# EAGLE design minimal_terminal (EAGLE 7.6.0)
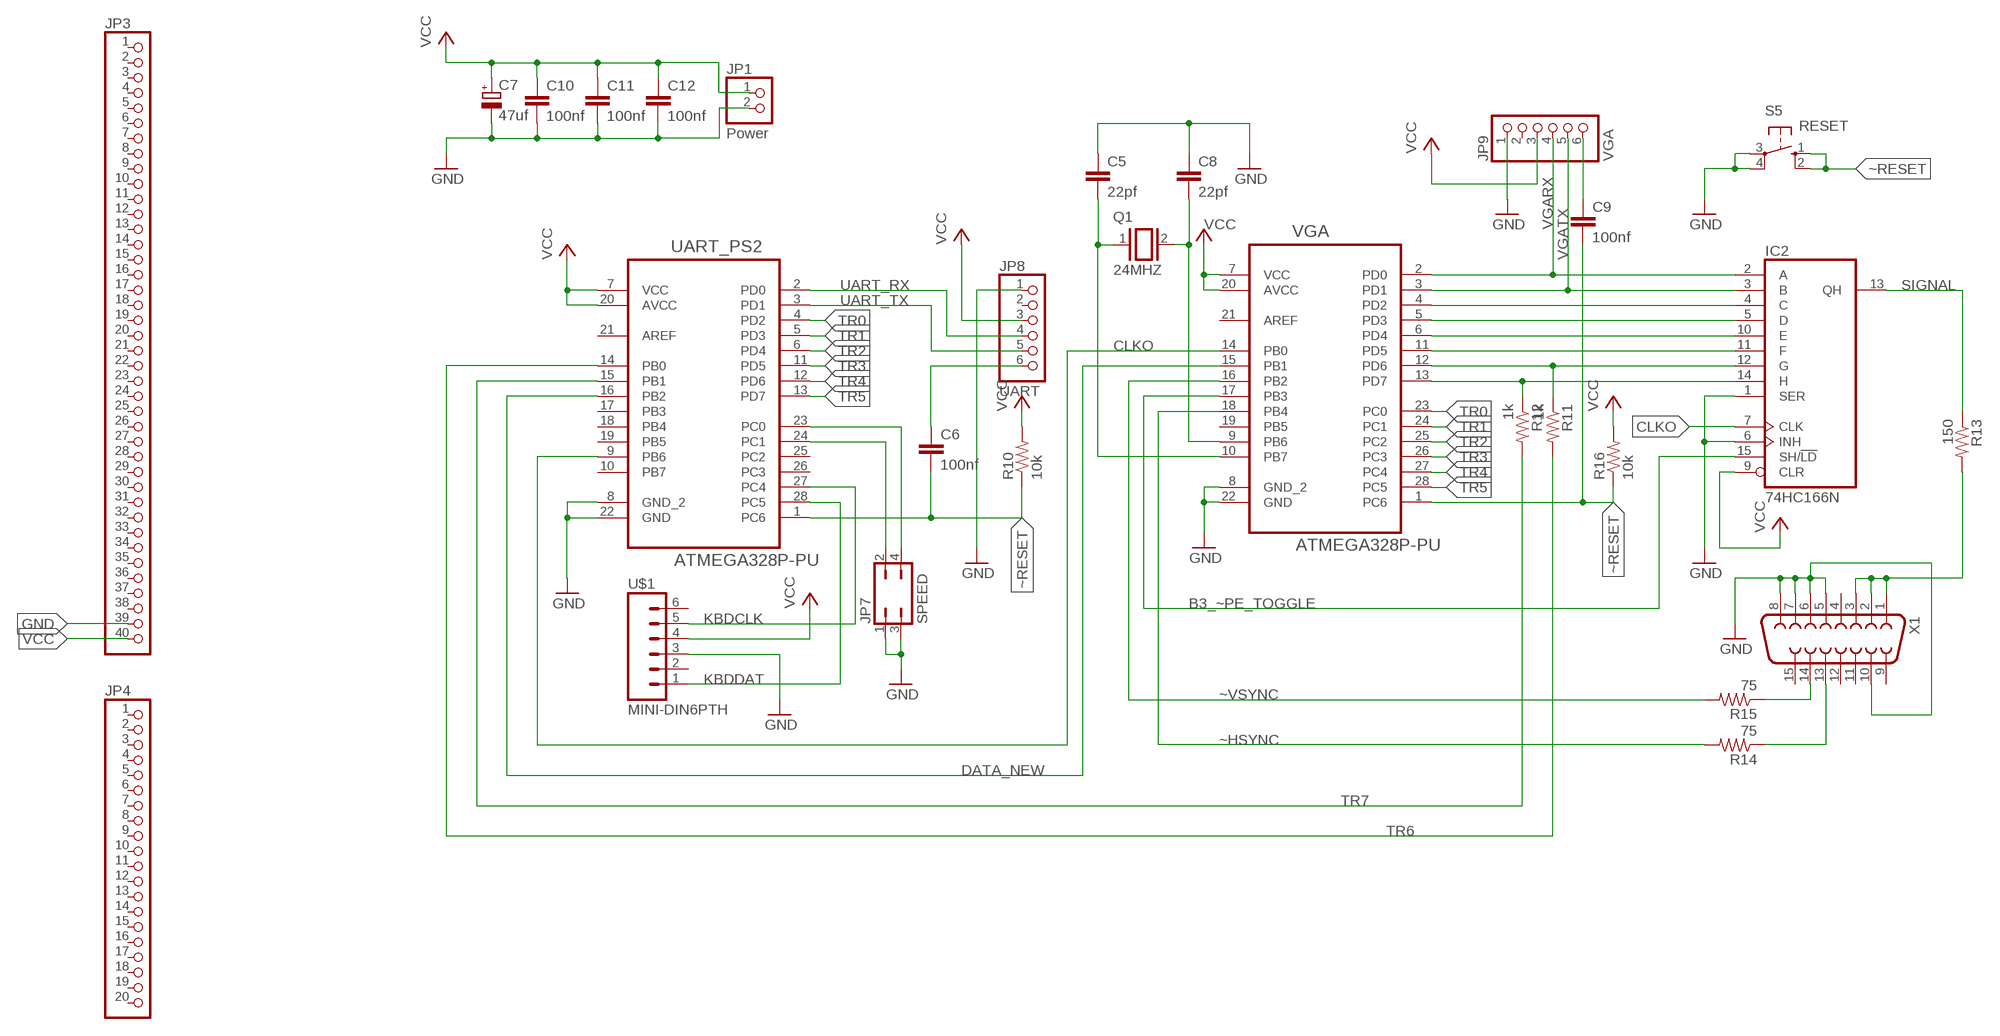
[diagram p0: schematic, sheet 1]

## Parts
C5  22pf  C2,5-3  [C2.5-3]
C6  100nf  C2,5-3  [C2.5-3]
C7  47uf  CPOL-EUE2.5-6  [E2,5-6]
C8  22pf  C2,5-3  [C2.5-3]
C9  100nf  C2,5-3  [C2.5-3]
C10  100nf  C2,5-3  [C2.5-3]
C11  100nf  C2,5-3  [C2.5-3]
C12  100nf  C2,5-3  [C2.5-3]
IC2  74HC166N  [DIL16]
JP1  Power  PINHD-1X2  [1X02]
JP3  PINHD-1X40  [1X40]
JP4  PINHD-1X20  [1X20]
JP7  SPEED  JP2Q  [JP2Q]
JP8  UART  PINHD-1X6  [1X06]
JP9  VGA  PINHD-1X6  [1X06]
Q1  24MHZ  XTAL  [Q]
R10  10k  R-US_0204/7  [0204/7]
R11  1k  R-US_0204/7  [0204/7]
R12  1k  R-US_0204/7  [0204/7]
R13  150  R-US_0204/7  [0204/7]
R14  75  R-US_0204/7  [0204/7]
R15  75  R-US_0204/7  [0204/7]
R16  10k  R-US_0204/7  [0204/7]
S5  RESET  10-XX  [B3F-10XX]
U$1  MINI-DIN6PTH  [MINI-DIN6]
UART_PS2  ATMEGA328P-PU  [DIP254P762X457-28]
VGA  ATMEGA328P-PU  [DIP254P762X457-28]
X1  F15HDH  [HDF15H]

## Nets
B3_~PE_TOGGLE: IC2.15(SH/!LD) VGA.17(PB3)
CLKO: IC2.7(CLK) UART_PS2.9(PB6) VGA.14(PB0)
DATA_NEW: UART_PS2.16(PB2) VGA.15(PB1)
GND [VCC]: C5.1 C7.- C8.1 C10.2 C11.2 C12.2 IC2.1(SER) IC2.6(INH) JP1.2 JP3.39 JP7.1 JP7.3 JP8.1 JP9.1 S5.3(P) S5.4(P1) U$1.3 UART_PS2.8(GND_2) UART_PS2.22(GND) VGA.8(GND_2) VGA.22(GND) X1.5 X1.6 X1.7 X1.8 X1.10
KBDCLK: U$1.5 UART_PS2.27(PC4)
KBDDAT: U$1.1 UART_PS2.28(PC5)
N$14: C6.1 JP8.6
N$15: JP7.2 UART_PS2.24(PC1)
N$16: JP7.4 UART_PS2.23(PC0)
N$17: IC2.12(G) R11.1 VGA.12(PD6)
N$18: IC2.14(H) R12.1 VGA.13(PD7)
N$21: IC2.4(C) VGA.4(PD2)
N$22: IC2.5(D) VGA.5(PD3)
N$23: IC2.10(E) VGA.6(PD4)
N$24: IC2.11(F) VGA.11(PD5)
N$26: R13.2 X1.1 X1.2 X1.3
N$27: R14.1 X1.13
N$28: R15.1 X1.14
N$29: C5.2 Q1.1 VGA.10(PB7)
N$30: C8.2 Q1.2 VGA.9(PB6)
N$31: C9.1 JP9.6
SIGNAL: IC2.13(QH) R13.1
TR0: UART_PS2.4(PD2) VGA.23(PC0)
TR1: UART_PS2.5(PD3) VGA.24(PC1)
TR2: UART_PS2.6(PD4) VGA.25(PC2)
TR3: UART_PS2.11(PD5) VGA.26(PC3)
TR4: UART_PS2.12(PD6) VGA.27(PC4)
TR5: UART_PS2.13(PD7) VGA.28(PC5)
TR6: R11.2 UART_PS2.14(PB0)
TR7: R12.2 UART_PS2.15(PB1)
UART_RX: JP8.4 UART_PS2.2(PD0)
UART_TX: JP8.5 UART_PS2.3(PD1)
VCC [VCC]: C7.+ C10.1 C11.1 C12.1 IC2.9(CLR) JP1.1 JP3.40 JP8.3 JP9.3 R10.2 R16.2 U$1.4 UART_PS2.7(VCC) UART_PS2.20(AVCC) VGA.7(VCC) VGA.20(AVCC)
VGARX: IC2.2(A) JP9.4 VGA.2(PD0)
VGATX: IC2.3(B) JP9.5 VGA.3(PD1)
~HSYNC: R14.2 VGA.18(PB4)
~RESET: C6.2 C9.2 R10.1 R16.1 S5.1(S) S5.2(S1) UART_PS2.1(PC6) VGA.1(PC6)
~VSYNC: R15.2 VGA.16(PB2)
Unconnected: JP3.1 JP3.2 JP3.3 JP3.4 JP3.5 JP3.6 JP3.7 JP3.8 JP3.9 JP3.10 JP3.11 JP3.12 JP3.13 JP3.14 JP3.15 JP3.16 JP3.17 JP3.18 JP3.19 JP3.20 JP3.21 JP3.22 JP3.23 JP3.24 JP3.25 JP3.26 JP3.27 JP3.28 JP3.29 JP3.30 JP3.31 JP3.32 JP3.33 JP3.34 JP3.35 JP3.36 JP3.37 JP3.38 JP4.1 JP4.2 JP4.3 JP4.4 JP4.5 JP4.6 JP4.7 JP4.8 JP4.9 JP4.10 JP4.11 JP4.12 JP4.13 JP4.14 JP4.15 JP4.16 JP4.17 JP4.18 JP4.19 JP4.20 JP8.2 JP9.2 U$1.2 U$1.6 UART_PS2.10(PB7) UART_PS2.17(PB3) UART_PS2.18(PB4) UART_PS2.19(PB5) UART_PS2.21(AREF) UART_PS2.25(PC2) UART_PS2.26(PC3) VGA.19(PB5) VGA.21(AREF) X1.4 X1.9 X1.11 X1.12 X1.15

## Power pins joined to a net without a drawn wire
GND: IC2.8(GND)
VCC: IC2.16(VCC)

## Library data of the parts
C5 C6 C8-C12 = capacitor-wima:C: CAPACITOR naming: grid - package width
C7 = rcl:CPOL-EU: POLARIZED CAPACITOR, European symbol
IC2 = 74xx-eu:74*166: 8-bit parallel load SHIFT REGISTER
JP1 = pinhead:PINHD-1X2: PIN HEADER
JP3 = pinhead:PINHD-1X40: PIN HEADER
JP4 = pinhead:PINHD-1X20: PIN HEADER
JP7 = jumper:JP2Q: JUMPER
JP8 JP9 = adafruit:PINHD-1X6: PIN HEADER
Q1 = special:XTAL: CRYSTAL
R10-R16 = adafruit:R-US_: RESISTOR, American symbol
S5 = switch-omron:10-XX: OMRON SWITCH; MPN: B3F-1000; OC_FARNELL: 176432; OC_NEWARK: 36M3542
U$1 = SparkFun-Connectors:MINI-DIN6: mini DIN 6 Connector Commonly found on the back of a computer for PS2 keyboard and mice. Schematic and footprint are proven. Spark Fun Electronics SKU : PRT-08509
UART_PS2 VGA = Atmel_By_element14_Batch_1-00:ATMEGA328P-PU: 8-bit Microcontroller with In-System Programmable Flash; MPN: ATMEGA328P-PU; OC_FARNELL: 1715487; OC_NEWARK: 15R0268; PACKAGE: PDIP-28; SUPPLIER: Atmel
X1 = adafruit:F15: SUB-D HDH is also known as a 'right angle VGA' connector

## Net classes
1 VCC: width 0.61 mm

## Board
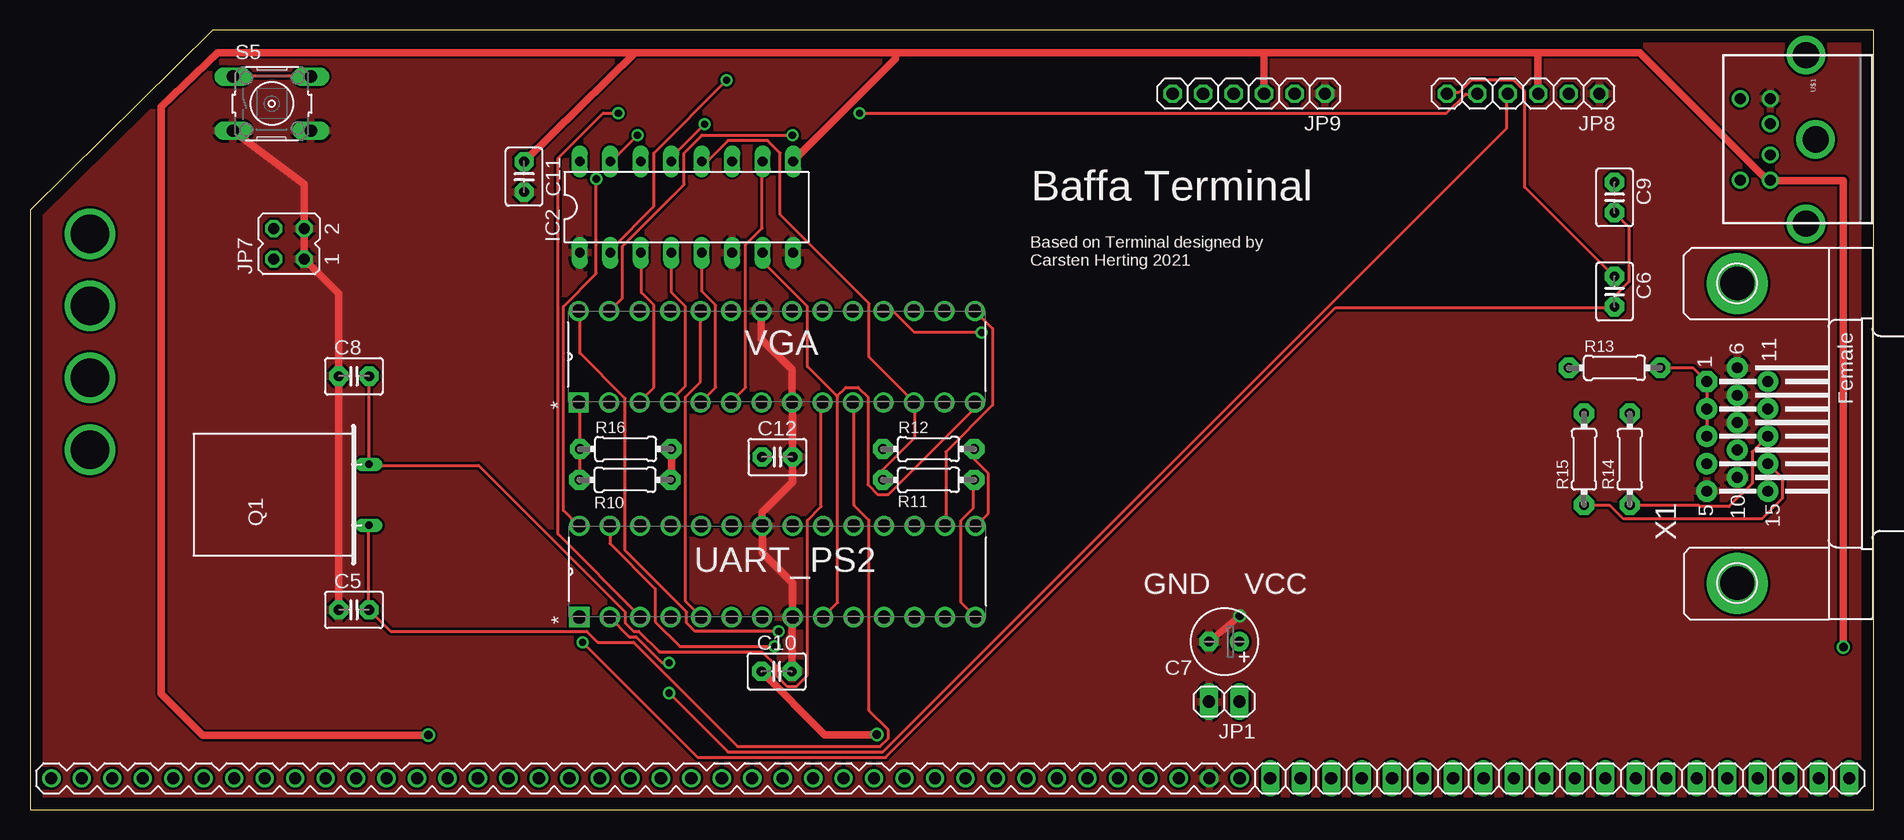
[diagram p1: board, top side]
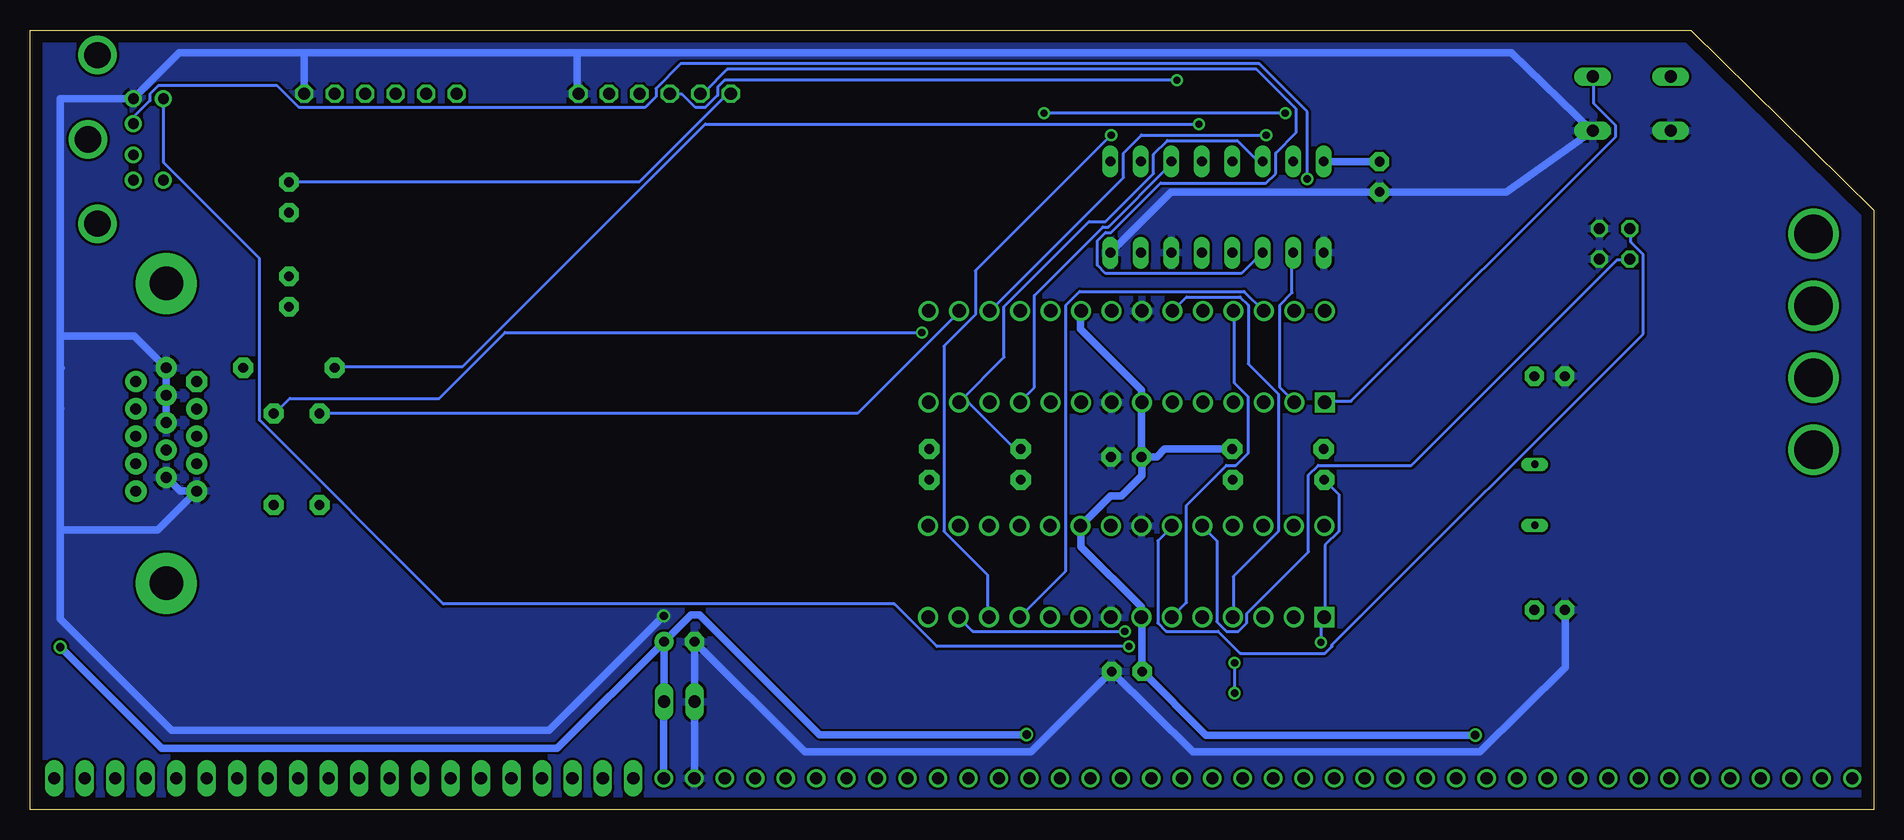
[diagram p2: board, bottom side, seen from below]

Size 153.67 x 65 mm. Coordinates in mm from the lower left corner, seen from the top.
Outline: 0,0 153.67,0 153.67,65 15.24,65 0,50 0,0
Copper layers (1*16): Top 0.035mm / dielectric 1.5mm / Bottom 0.035mm
Design rules "default": minimum track width 10mil, minimum drill 24mil, track to track 8mil, track to pad 8mil, pad to pad 8mil, via to via 8mil, smd to smd 8mil, copper to edge 40mil, drill to drill 8mil, minimum pad ring 10mil, minimum via ring 8mil, stop-mask expansion 4mil, vias tented up to drill 0mil, thermal gap 10mil

### Footprints (pad centres in the part's own frame; a part is rotated, then mirrored left to right if it is on the bottom)
C2.5-3 = drill 0.813 pad 1.6 octagon: 1 -1.27,0; 2 1.27,0
E2,5-6 = drill 0.813 pad 1.6: + -1.27,0 | drill 0.813 pad 1.6 octagon: - 1.27,0
DIL16 = drill 0.813 long: 1 -8.89,-3.81; 2 -6.35,-3.81; 3 -3.81,-3.81; 4 -1.27,-3.81; 5 1.27,-3.81; 6 3.81,-3.81; 7 6.35,-3.81; 8 8.89,-3.81; 9 8.89,3.81; 10 6.35,3.81; 11 3.81,3.81; 12 1.27,3.81; 13 -1.27,3.81; 14 -3.81,3.81; 15 -6.35,3.81; 16 -8.89,3.81
1X02 = drill 1.016 long: 1 -1.27,0; 2 1.27,0
1X40 = drill 1.016: 1 -49.53,0; 2 -46.99,0; 3 -44.45,0; 4 -41.91,0; 5 -39.37,0; 6 -36.83,0; 7 -34.29,0; 8 -31.75,0; 9 -29.21,0; 10 -26.67,0; 11 -24.13,0; 12 -21.59,0; 13 -19.05,0; 14 -16.51,0; 15 -13.97,0; 16 -11.43,0; 17 -8.89,0; 18 -6.35,0; 19 -3.81,0; 20 -1.27,0; 21 1.27,0; 22 3.81,0; 23 6.35,0; 24 8.89,0; 25 11.43,0; 26 13.97,0; 27 16.51,0; 28 19.05,0; 29 21.59,0; 30 24.13,0; 31 26.67,0; 32 29.21,0; 33 31.75,0; 34 34.29,0; 35 36.83,0; 36 39.37,0; 37 41.91,0; 38 44.45,0; 39 46.99,0; 40 49.53,0
1X20 = drill 1.016 long: 1 -24.13,0; 2 -21.59,0; 3 -19.05,0; 4 -16.51,0; 5 -13.97,0; 6 -11.43,0; 7 -8.89,0; 8 -6.35,0; 9 -3.81,0; 10 -1.27,0; 11 1.27,0; 12 3.81,0; 13 6.35,0; 14 8.89,0; 15 11.43,0; 16 13.97,0; 17 16.51,0; 18 19.05,0; 19 21.59,0; 20 24.13,0
JP2Q = drill 0.914 octagon: 1 -1.27,-1.27; 2 -1.27,1.27; 3 1.27,-1.27; 4 1.27,1.27
1X06 = drill 1.016 octagon: 1 -6.35,0; 2 -3.81,0; 3 -1.27,0; 4 1.27,0; 5 3.81,0; 6 6.35,0
Q = drill 0.61 long: 1 -2.54,-7.62; 2 2.54,-7.62
0204/7 = drill 0.813 pad 1.676 octagon: 1 -3.81,0; 2 3.81,0
B3F-10XX = drill 1.016 long: 1 -3.251,2.261; 2 3.251,2.261; 3 -3.251,-2.261; 4 3.251,-2.261
MINI-DIN6 = drill 0.9: 1 -1.3,-8.5; 2 1.3,-8.5; 3 -3.4,-8.5; 4 3.4,-8.5; 5 -3.4,-11; 6 3.4,-11 | drill 2.2: P$1 0,-4.7
DIP254P762X457-28 = drill 1.118 square: 1 -7.62,33.02 | drill 1.118: 2 -7.62,30.48; 3 -7.62,27.94; 4 -7.62,25.4; 5 -7.62,22.86; 6 -7.62,20.32; 7 -7.62,17.78; 8 -7.62,15.24; 9 -7.62,12.7; 10 -7.62,10.16; 11 -7.62,7.62; 12 -7.62,5.08; 13 -7.62,2.54; 14 -7.62,0; 15 0,0; 16 0,2.54; 17 0,5.08; 18 0,7.62; 19 0,10.16; 20 0,12.7; 21 0,15.24; 22 0,17.78; 23 0,20.32; 24 0,22.86; 25 0,25.4; 26 0,27.94; 27 0,30.48; 28 0,33.02
HDF15H = drill 0.9 pad 1.778 octagon: 1 4.329,2.54 | drill 0.9 pad 1.778: 2 2.043,2.54; 3 -0.243,2.54; 4 -2.529,2.54; 5 -4.815,2.54; 6 5.472,0; 7 3.186,0; 8 0.9,0; 9 -1.386,0; 10 -3.672,0; 11 4.329,-2.54; 12 2.043,-2.54; 13 -0.243,-2.54; 14 -2.529,-2.54; 15 -4.815,-2.54 | drill 2.8 pad 5.08: P$1 -12.5,0; P$2 12.5,0

### Placement (x,y rotation side)
C5  27,16.65 0 top
C6  132.08,43.19 270 top
C7  99.55,14 180 top
C8  27,36.13 0 top
C9  132.08,51.04 270 top
C10  62.24,11.51 0 top
C11  41.18,52.76 270 top
C12  62.29,29.39 0 top
IC2  54.72,50.24 0 top
JP1  99.55,9 180 top
JP3  51.31,2.6 0 top
JP4  127.51,2.6 0 top
JP7  21.59,47.17 90 top
JP8  124.46,59.69 180 top
JP9  101.6,59.69 180 top
Q1  20.62,26.24 90 top
R10  49.6,27.49 0 top
R11  74.9,27.49 0 top
R12  74.9,30.06 0 top
R13  132.08,36.83 0 top
R14  133.35,29.21 90 top
R15  129.54,29.21 90 top
R16  49.65,30.06 0 top
S5  20.16,58.86 0 top
U$1  153.55,55.88 270 top
UART_PS2  78.81,23.66 90 top
VGA  78.76,41.57 90 top
X1  142.31,31.36 90 top

### Tracks (layer width: path | path; a pad name or v marks a point on that pad's centre or on a via)
B3_~PE_TOGGLE  (via drill 0.61)
  Top 0.254: v50.63,56.24 48.46,54.06 IC2.15
  Bottom 0.254: v50.63,56.24 61.04,56.24 62.52,54.75 62.52,52.69 73.61,41.6 VGA.17
CLKO
  Top 0.254: 67.27,34.46 67.32,34.4 67.32,17.26 66.18,16.12 UART_PS2.9 | 67.27,34.46 64.81,36.92 64.81,41.95 61.15,45.61 61.15,46.41 IC2.7 | 67.27,34.46 68.01,35.2 69.04,35.2 69.84,34.4 69.84,27.09 70.64,26.29 71.55,26.29 78.75,33.49 VGA.14
DATA_NEW
  Top 0.254: UART_PS2.16 76.35,23.66 76.35,29.83 80.24,33.72 80.24,40.12 78.87,41.49 VGA.15
GND  (via drill 0.7)
  Top 0.61: C5.1 C8.1 25.73,43.03 JP7.1 JP7.3 22.86,52.15 S5.3 | v100.85,16.15 C7.- | C10.2 63.51,15.98 UART_PS2.8 63.57,18.88 61.05,21.4 61.05,23.64 UART_PS2.22 61.03,24.78 63.55,27.3 C12.2 63.56,33.91 VGA.8 63.52,36.68 60.95,39.25 60.95,41.54 VGA.22
  Bottom 0.61: JP3.39 98.28,2.62 JP1.2 C7.- 89.08,4.8 70.22,4.8 C10.2 56.75,4.8 32.8,4.8 25.7,11.85 25.7,16.62 C5.1 | 108.05,63.1 30.2,63.1 23.5,56.6 S5.4 30.62,51.49 C11.2 58.55,51.49 IC2.8 | 108.05,63.1 130.8,63.1 | 130.8,63.1 141.23,63.1 U$1.3 151.15,59.28 151.15,39.5 | 151.15,39.5 151.15,36.75 | 151.15,36.75 151.15,33.45 | 151.15,33.45 151.15,26.55 | 151.15,26.55 151.15,23.3 | 151.15,23.3 151.15,15.9 141.85,6.6 110.4,6.6 v100.85,16.15 | 151.13,33.43 151.15,33.45 | 151.13,26.57 151.15,26.55 | JP8.1 130.81,63.09 130.8,63.1 | 108.05,63.1 108.05,59.79 JP9.1 | X1.8 X1.7 X1.6 144.98,39.5 151.15,39.5 | 151.07,36.83 151.15,36.75 | X1.10 141.17,26.55 X1.5 143.01,23.3 151.15,23.3
  pour Top: 0,0 0,50 15.24,65 153.67,65 153.67,0
  pour Bottom: 0,0 0,50 15.24,65 153.67,65 153.67,0
KBDCLK  (via drill 0.61)
  Top 0.254: v62.06,13.6 54.18,13.6 52.12,15.66 52.12,18.4 48.35,22.17 48.35,23.55 UART_PS2.27
  Bottom 0.254: v62.06,13.6 78.07,13.6 81.61,17.14 119.22,17.14 134.53,32.46 134.53,45.95 142.53,53.95 142.53,59.21 U$1.5
KBDDAT  (via drill 0.61)
  Top 0.254: v47.21,52.58 47.21,44.69 44.46,41.95 44.46,24.92 45.72,23.66 UART_PS2.28
  Bottom 0.254: v47.21,52.58 47.21,58.18 51.21,62.18 99.44,62.18 101.5,60.12 101.5,59.44 102.41,58.52 131.22,58.52 133.04,60.35 142.99,60.35 143.68,59.66 143.68,59.09 145.05,57.72 145.05,57.26 U$1.1
N$1  (via drill 3.2)
  other vias: 5,42
N$2  (via drill 3.2)
  other vias: 5,30
N$3  (via drill 2.2)
  other vias: 148.05,48.85
N$4  (via drill 2.2)
  other vias: 148.05,62.9
N$14
  Top 0.254: JP8.6 118.19,59.78 119.1,59.78 120.13,60.81 123.67,60.81 124.59,59.89 124.59,51.89 132.02,44.46 C6.1
N$15
  Bottom 0.254: JP7.2 20.34,45.83 21.37,45.83 38.52,28.69 46.29,28.69 47.09,27.89 47.09,21.49 52.23,16.34 52.23,15.54 52.92,14.86 53.95,14.86 54.75,15.66 54.75,22.4 55.89,23.55 UART_PS2.24
N$16
  Bottom 0.254: JP7.4 20.23,48.35 20.23,47.32 19.2,46.29 19.2,39.66 45.15,13.72 45.15,13.6 45.72,13.03 52.81,13.03 54.63,14.86 58.98,14.86 59.66,15.54 59.66,22.4 58.52,23.55 UART_PS2.23
N$17
  Top 0.254: IC2.12 56.01,54.06 56.46,54.06 58.18,55.78 61.49,55.78 62.52,54.75 62.52,49.61 69.95,42.18 69.95,37.72 73.61,34.06 VGA.12 73.72,33.83 73.72,30.98 71.09,28.35 71.09,27.55 R11.1
N$18
  Bottom 0.254: IC2.14 50.98,54.06 51.32,54.06 53.03,55.78 58.86,55.78 60.01,54.63 60.01,53.03 64.01,49.03 65.38,49.03 72.47,41.95 72.47,37.72 76.12,34.06 VGA.13 75.78,34.29 71.55,30.06 R12.1
N$20  (via drill 3.2)
  other vias: 5,48
N$21
  Top 0.254: IC2.4 53.49,46.41 53.49,43.09 54.63,41.95 54.63,35.32 53.38,34.06 VGA.4
N$22
  Top 0.254: IC2.5 56.01,46.41 56.01,43.2 57.15,42.06 57.15,35.2 56.01,34.06 VGA.5
N$23
  Top 0.254: IC2.10 61.04,53.95 61.04,48.46 59.66,47.09 59.66,35.2 58.52,34.06 VGA.6
N$24
  Bottom 0.254: IC2.11 58.64,53.95 58.64,53.72 63.78,48.58 64.24,48.58 69.95,42.86 69.95,35.2 71.09,34.06 VGA.11
N$25  (via drill 3.2)
  other vias: 5,36
N$26
  Top 0.254: X1.3 139.79,31.2 139.79,33.38 X1.2 139.79,33.49 139.79,35.66 X1.1 139.68,35.78 138.65,36.8 135.9,36.8 R13.2
N$27
  Top 0.254: R14.1 133.39,25.38 139.1,25.38 139.22,25.26 141.62,25.26 143.56,27.2 143.56,29.83 144.82,31.09 X1.13
N$28
  Top 0.254: R15.1 129.62,25.38 131.67,25.38 132.82,24.23 144.36,24.23 146.07,25.95 146.07,27.66 144.93,28.8 X1.14
N$29
  Top 0.254: Q1.1 28.23,23.66 28.23,16.69 C5.2 28.35,16.57 30.06,14.86 46.41,14.86 47.32,13.95 50.29,13.95 58.98,5.26 70.87,5.26 71.55,5.94 71.55,6.63 69.95,8.23 69.95,24.12 68.69,25.38 68.69,33.95 VGA.10
N$30
  Top 0.254: C8.2 28.23,36.12 28.23,28.8 Q1.2 28.35,28.69 37.38,28.69 49.61,16.46 49.61,15.54 50.29,14.86 50.75,14.86 52.46,13.14 61.04,13.14 62.18,12 62.18,11.2 63.09,10.29 63.89,10.29 64.81,11.2 64.81,24.12 65.95,25.26 65.95,33.95 VGA.9
N$31
  Bottom 0.254: JP9.6 95.33,59.66 95.56,59.66 102.87,52.35 132.02,52.35 C9.1
SIGNAL  (via drill 0.61)
  Top 0.254: v56.24,57.15 53.49,54.41 53.49,54.06 IC2.13
  Bottom 0.254: v56.24,57.15 97.38,57.15 117.61,36.92 128.25,36.92 R13.1
TR0
  Bottom 0.254: UART_PS2.4 53.38,16.12 53.38,19.43 49.61,23.2 49.61,34.63 52.12,37.15 52.12,42.06 52.81,42.75 57.26,42.75 58.41,41.6 VGA.23
TR1
  Top 0.254: VGA.24 55.89,41.49 55.89,35.66 54.63,34.4 54.63,17.37 55.89,16.12 UART_PS2.5
TR2
  Bottom 0.254: VGA.25 53.26,41.49 53.26,35.55 52.12,34.4 52.12,29.72 53.15,28.69 53.95,28.69 57.26,25.38 57.26,17.26 58.41,16.12 UART_PS2.6
TR3
  Bottom 0.254: VGA.26 50.86,41.6 52.46,43.2 66.18,43.2 67.32,42.06 67.32,19.89 71.09,16.12 UART_PS2.11
TR4  (via drill 0.61)
  Top 0.254: v63.55,56.24 56.01,56.24 54.52,54.75 54.52,52.12 49.38,46.98 49.38,42.63 48.35,41.6 VGA.27
  Bottom 0.254: v63.55,56.24 74.87,44.92 74.87,41.26 77.5,38.63 77.5,23.2 73.84,19.55 73.84,16.12 UART_PS2.12
TR5  (via drill 0.61)
  Top 0.254: v62.41,14.86 55.44,14.86 54.75,15.54 54.75,16.46 49.61,21.6 49.61,34.29 45.83,38.06 45.83,41.49 VGA.28
  Bottom 0.254: v62.41,14.86 75.09,14.86 76.24,16 UART_PS2.13
TR6
  Top 0.254: R11.2 78.64,27.43 78.64,25.15 77.61,24.12 77.61,17.26 78.75,16.12 UART_PS2.14
TR7
  Top 0.254: R12.2 78.75,29.95 78.75,29.15 79.9,28 79.9,24.69 78.87,23.66 UART_PS2.15
UART_RX  (via drill 0.61)
  Top 0.254: v53.26,9.72 58.18,4.8 71.09,4.8 123.1,56.81 123.1,59.66 JP8.4 | v53.26,12.23 52.69,12.23 50.52,14.4 49.95,14.4 48.35,16 UART_PS2.2
  Bottom 0.254: v53.26,12.23 v53.26,9.72
UART_TX  (via drill 0.61)
  Top 0.254: v69.15,58.06 118.07,58.06 119.67,59.66 120.59,59.66 JP8.5 | v49.03,58.06 47.78,58.06 44.01,54.29 44.01,22.97 50.86,16.12 UART_PS2.3
  Bottom 0.254: v49.03,58.06 v69.15,58.06
VCC  (via drill 0.7)
  Top 0.61: v70.6,6.25 66.23,6.25 C10.1 | v151.15,13.55 151.15,52.4 | 151.15,52.4 151.15,52.45 | 125.7,63.1 134.2,63.1 144.82,52.48 U$1.4 | 125.7,63.1 102.85,63.1 | 102.85,63.1 72.15,63.1 | 72.15,63.1 50.45,63.1 | 50.45,63.1 C11.1 | 50.45,63.1 15.65,63.1 10.95,58.6 10.95,9.65 14.4,6.2 v33.2,6.2 | JP9.3 102.85,59.71 102.85,63.1 | JP8.3 125.7,59.72 125.7,63.1 | IC2.9 72.15,62.59 72.15,63.1 | R10.2 53.46,27.54 R16.2 | 151.15,52.4 151.1,52.45 145.05,52.45
  Bottom 0.61: C12.1 61,29.37 61,27.85 62.7,26.15 63.6,26.15 66.09,23.66 UART_PS2.20 66.05,23.6 66.05,21.9 61.03,16.88 UART_PS2.7 60.97,15.98 C10.1 55.65,6.2 v33.2,6.2 33.15,6.2 33.1,6.25 | C12.1 61.02,33.91 | 61.02,33.91 VGA.7 | 61.02,33.91 61.02,34.97 66.1,40.05 66.1,41.53 VGA.20 | C7.+ 98.57,16.25 97.85,16.25 87.85,6.25 v70.6,6.25 | C7.+ 109.72,5.1 142.7,5.1 v151.15,13.55 | C11.1 45.81,54.03 IC2.16 | R16.2 59.09,30.06 59.75,29.4 C12.1 | JP3.40 100.84,8.98 JP1.1 C7.+
VGARX  (via drill 0.61)
  Top 0.254: v58.06,60.81 52.01,54.75 52.01,50.29 48.46,46.75 48.46,46.52 IC2.2
  Bottom 0.254: IC2.2 48.46,46.41 48.46,43.09 49.49,42.06 49.49,35.2 48.35,34.06 VGA.2 | v58.06,60.81 95.78,60.81 96.36,60.24 96.36,59.55 97.38,58.52 98.18,58.52 99.33,59.66 100.24,59.66 JP9.4
VGATX
  Top 0.254: IC2.3 50.98,46.41 50.98,43.09 52.01,42.06 52.01,35.2 50.86,34.06 VGA.3
  Bottom 0.254: JP9.5 97.73,59.78 97.5,59.78 95.56,61.72 51.44,61.72 48.12,58.41 48.12,56.46 49.84,54.75 49.84,53.03 50.63,52.23 59.44,52.23 63.55,48.12 64.01,48.12 64.69,47.43 64.69,45.38 64.01,44.69 52.69,44.69 50.98,46.41 IC2.3
~HSYNC  (via drill 0.61)
  Top 0.254: v79.32,39.78 73.72,39.78 72.01,41.49 71.21,41.49 VGA.18
  Bottom 0.254: v79.32,39.78 114.07,39.78 119.56,34.29 132.02,34.29 133.27,33.03 R14.2
~RESET  (via drill 0.61)
  Top 0.254: C9.2 132.13,49.72 133.27,48.58 133.27,44.01 132.13,42.86 132.13,41.95 C6.2 132.02,41.83 108.81,41.83 71.32,4.34 55.66,4.34 v46.06,13.95 | S5.1 16.92,61.15 23.32,61.15 S5.2 | R10.1 45.83,27.55 45.83,29.95 R16.1 45.83,30.18 45.83,33.95 VGA.1
  Bottom 0.254: R10.1 45.72,27.43 44.58,26.29 44.58,23.2 45.72,22.06 45.72,16.12 UART_PS2.1 45.83,16 46.06,15.77 v46.06,13.95 | S5.2 23.32,61.04 23.32,58.86 21.49,57.04 21.49,56.12 43.55,34.06 45.72,34.06 VGA.1
~VSYNC
  Bottom 0.254: R15.2 129.5,33.03 84.7,33.03 76.24,41.49 VGA.16

### Text on the board
tNames: Baffa Terminal | Based on Terminal designed by / Carsten Herting 2021 | GND VCC